# Altium schematic sheet POWER.SchDoc
size A4
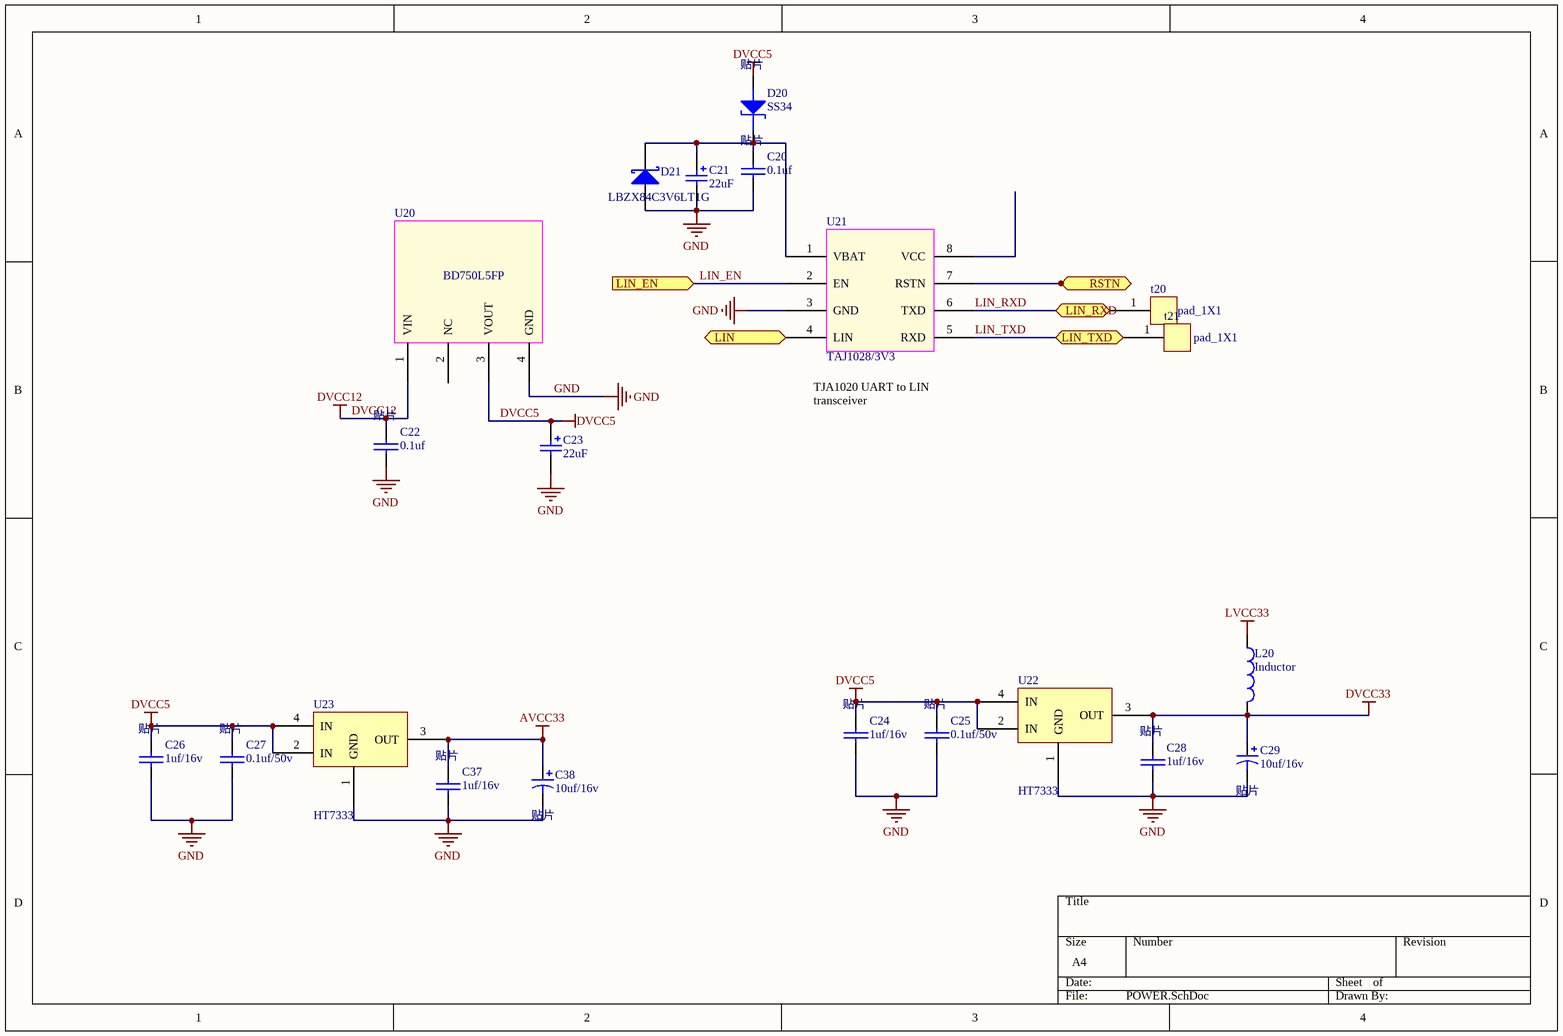
[diagram p0: POWER.SchDoc]

## Parts
C20  0.1uf  [C0402]
C21  22uF  [C0603]
C22  0.1uf  [C0402]
C23  22uF  [C0603]
C24  1uf/16v  [C0402]
C25  0.1uf/50v  [C0402]
C26  1uf/16v  [C0402]
C27  0.1uf/50v  [C0402]
C28  1uf/16v  [C0402]
C29  10uf/16v  [AVX_A]
C37  1uf/16v  [C0402]
C38  10uf/16v  [AVX_A]
D20  SS34  [BGY220D]
D21  LBZX84C3V6LT1G  [SOT-23_N]
L20  Inductor  [L0402]
t20  pad_1X1  [pad_0603]
t21  pad_1X1  [pad_0603]
U20  BD750L5FP  [TO252-3]
U21  TAJ1028/3V3  [SO-8]
U22  HT7333  [SOT-89]
U23  HT7333  [SOT-89]

## Ports
LIN (in), LIN_EN (in), LIN_RXD, LIN_TXD, RSTN

## Nets
AVCC33: C37.1 C38.1 U23.3(OUT)
DVCC5: C23.1 C24.1 C25.1 C26.1 C27.1 D20.1(A) U20.3(VOUT) U22.2(IN) U22.4(IN) U23.2(IN) U23.4(IN)
DVCC12: C22.1 U20.1(VIN)
DVCC33: C28.1 C29.1 L20.2 U22.3(OUT)
GND: C20.2 C21.2 C22.2 C23.2 C24.2 C25.2 C26.2 C27.2 C28.2 C29.2 C37.2 C38.2 D21.1(A) U20.4(GND) U21.3(GND) U22.1(GND) U23.1(GND)
LVCC33: L20.1
LIN: U21.4(LIN) ; port LIN
LIN_EN: U21.2(EN) ; port LIN_EN
LIN_RXD: t20.1 U21.6(TXD) ; port LIN_RXD
LIN_TXD: t21.1 U21.5(RXD) ; port LIN_TXD
RSTN: U21.7(RSTN) ; port RSTN
NetC20_1: C20.1 C21.1 D20.2(K) D21.3(K) U21.1(VBAT)

Not connected (* = marked no-connect by the designer): U20 2(NC); U21 8(VCC)

## Notes on the sheet
- (near U21) TJA1020 UART to LIN transceiver
- (in symbol 1N5819) 贴片
- (in symbol Cap Pol3) 贴片
- (in symbol CC) 贴片

## Library data of the parts
C20 C22 = CC: 大小: 0.1uf/50v; 封?: 0603
C21 C23 = CTaA: Tantalum Capacitor A; Published: 8-Jun-2000; LatestRevisionDate: 29-May-2009; LatestRevisionNote: IPC-7351 Footprint Added.; PackageReference: 3216; Publisher: Altium Limited; PackageDescription: Chip Capacitor; Value: 22uF
C24-C28 C37 = CC: 封?: 0603
  C24 C26 C28 C37: 大?: 1uf/16v
  C25 C27: 大?: 0.1uf/50v
C29 C38 = Cap Pol3: Polarized Capacitor (Surface Mount); 封?: CE4.3*4.3; 大?: 10uf/16v; 价?: *; 型?: *; 资?: *
D20 = 1N5819: 型?: 1N5819/SS14; 产?: *; 厂?: *; 大?: *; 封?: *; 价?: *; 资?: *
D21 = Diode BAS70: Silicon AF Schottky Diode for High-Speed Switching; Note: Pin 2 is not connected and not drawn.; Published: 21-Mar-2003; LatestRevisionDate: 29-May-2009; LatestRevisionNote: IPC-7351 Footprint Added.; DatasheetVersion: Oct-1999; PackageVersion: Sep-2001; PackageReference: SOT-23; Publisher: Altium Limited; PackageDescription: 3-Pin SOT-23 Package 0.95 mm Pitch, 2.5 mm Lead Span; ComponentLink1Description: Manufacturer Link; ComponentLink1URL: http://www.infineon.com/; ComponentLink2Description: Datasheet; ComponentLink2URL: http://www.infineon.com/upload/Document/cmc_upload/documents/009/382/bas40_bas140series_1.pdf
L20 = Inductor: Code_IEC: 1005; Published: 8-Jun-2000; LatestRevisionDate: 29-May-2009; LatestRevisionNote: IPC-7351 Footprint Added.; PackageReference: 0402-A; Publisher: Altium Limited; PackageDescription: Chip Inductor; Code_JEITA: 0402
U20 = BD733L5FP
U21 = TAJ1020